# EAGLE design pulseSensor (EAGLE 8.2.2)
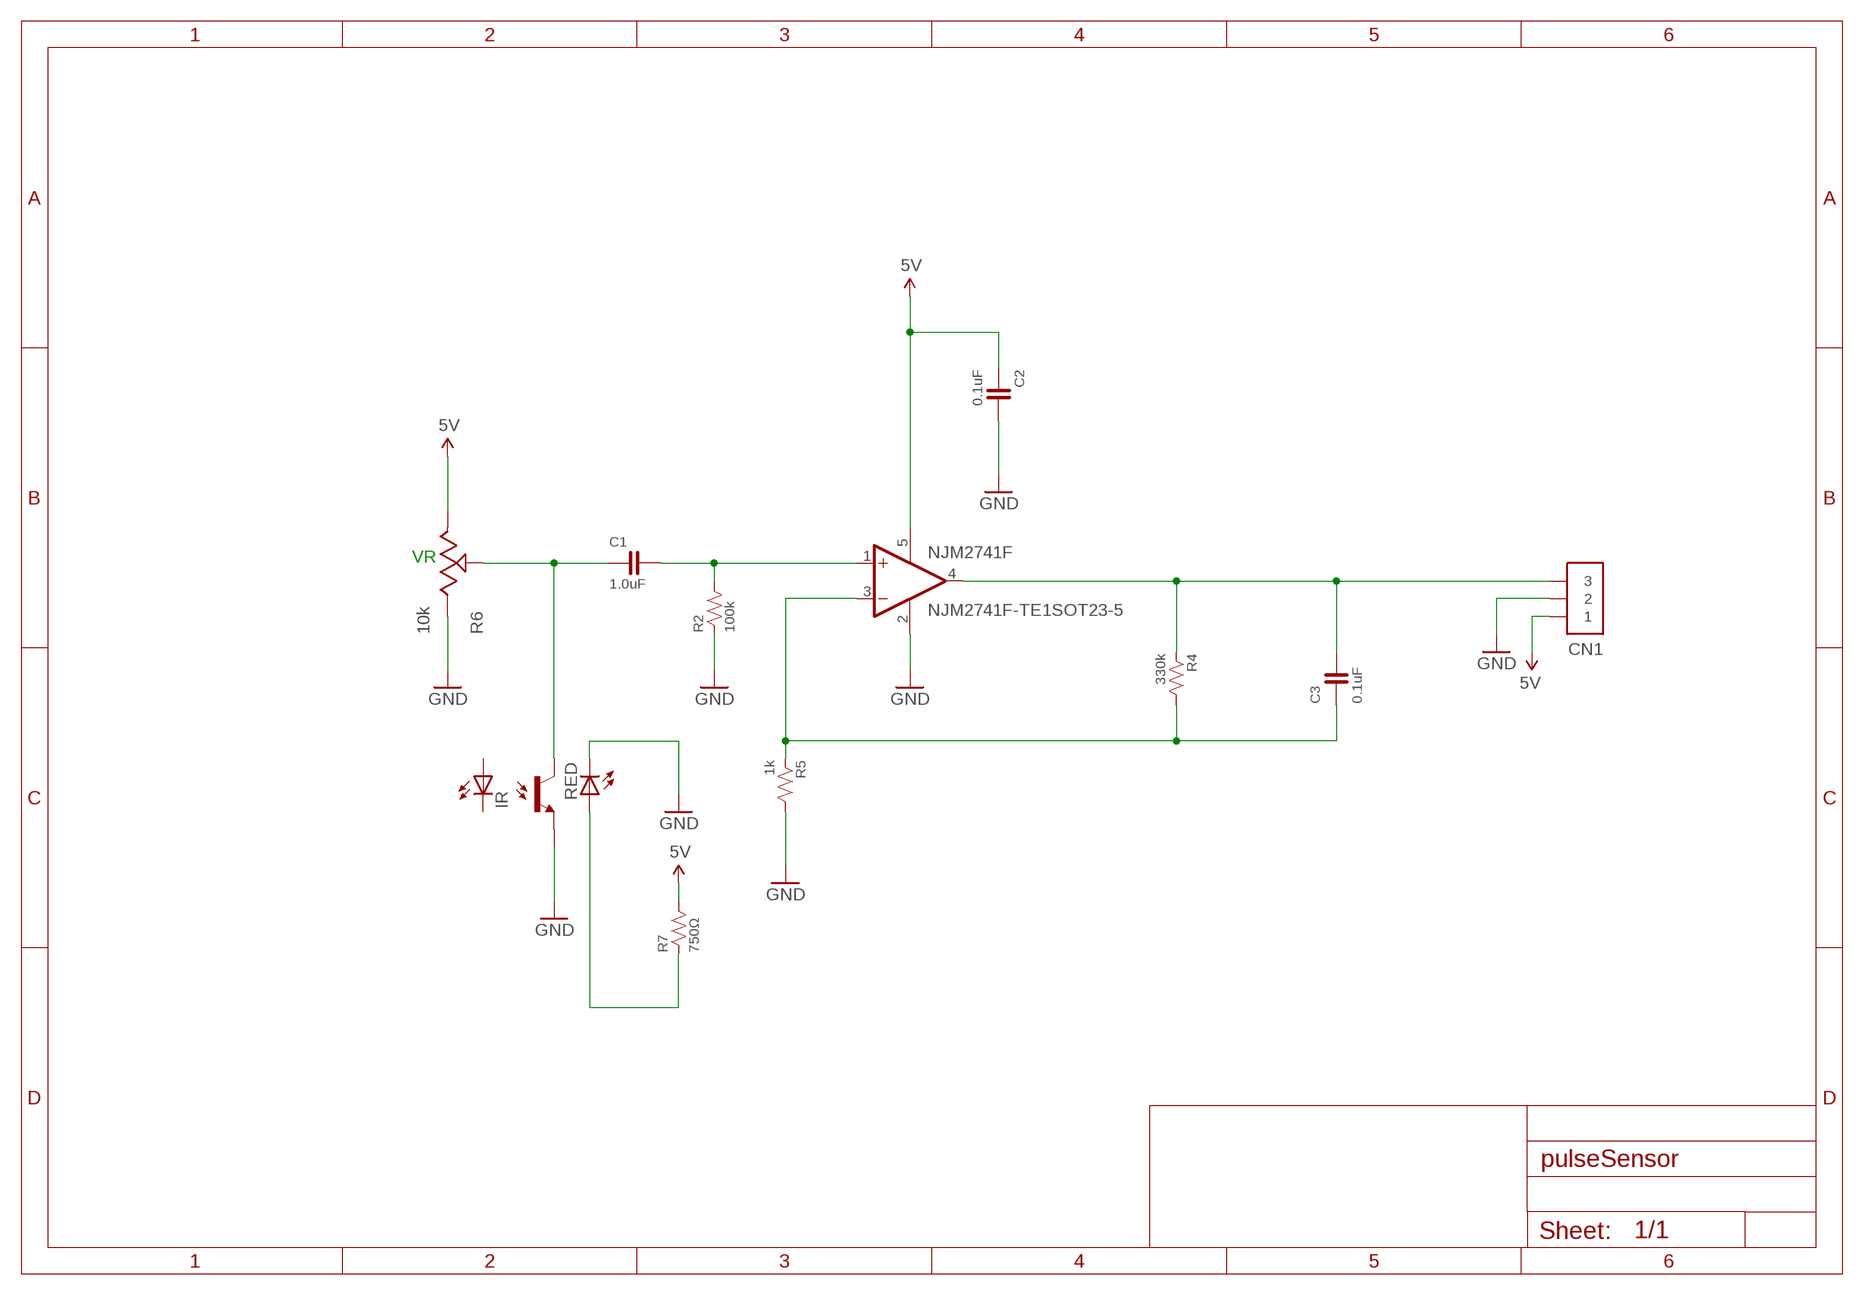
[diagram p0: schematic, sheet 1]

## Parts
C1  1.0uF  CAPACITOR-0603  [0603]
C2  0.1uF  CAPACITOR-0603  [0603]
C3  0.1uF  CAPACITOR-0603  [0603]
CN1  PIN_HEADER_1X3  [PIN_1X3]
NJL1  NJL5501R-TE1  [NJL5501R-PAC]
NJM2741F1  NJM2741F-TE1SOT23-5  [NJL5501R-PAC]
R2  100k  RESISTOR-0603  [0603]
R4  330k  RESISTOR-0603  [0603]
R5  1k  RESISTOR-0603  [0603]
R6  10k  RESISTOR_VARIABLE-SMD  [TC33X]
R7  750Ω  RESISTOR-0603  [0603]

## Nets
5V: C2.1 CN1.1 NJM2741F1.5(V+) R6.1 R7.2
GND: C2.2 CN1.2 NJL1.1 NJM2741F1.2(GND) R2.1 R5.2 R6.3
N$1: C3.2 CN1.3 NJM2741F1.4(OUT) R4.1
N$2: C1.1 NJL1.5 R6.2
N$3: C3.1 NJM2741F1.3(-IN) R4.2 R5.1
N$4: NJL1.6 R7.1
N$8: C1.2 NJM2741F1.1(+IN) R2.2
Unconnected: NJL1.2 NJL1.3 NJL1.4

## Notes on the sheet
- VR

## Library data of the parts
C1-C3 = FaBo-Capacitor:CAPACITOR: CAPACITOR
CN1 = FaBo-PIN:PIN_HEADER_1X3
NJL1 = njl5501r:NJL5501R-TE1
NJM2741F1 = NJM2741F-TE1:NJM2741F-TE1
R2 R4 R5 R7 = FaBo-Resistors:RESISTOR: RESISTOR
R6 = FaBo-Resistors:RESISTOR_VARIABLE

## Board
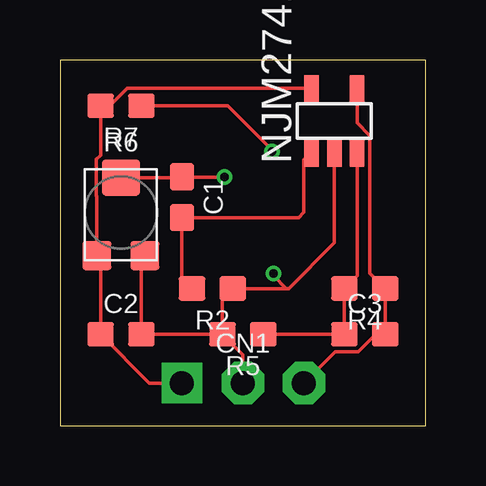
[diagram p1: board, top side]
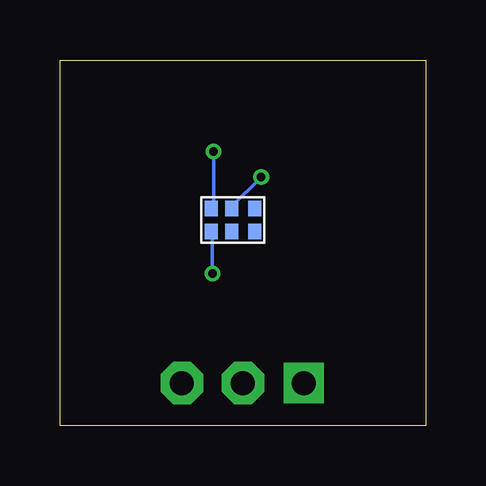
[diagram p2: board, bottom side, seen from below]

Size 15.24 x 15.24 mm. Coordinates in mm from the lower left corner, seen from the top.
Outline: 0,0 15.24,0 15.24,15.24 0,15.24 0,0
Copper layers (1*16): Top 0.035mm / dielectric 1.5mm / Bottom 0.035mm
Design rules "SeeedStudio_2layer_DRU_no_angle_20140221": minimum track width 6mil, minimum drill 12mil, track to track 6mil, track to pad 6mil, pad to pad 6mil, via to via 6mil, smd to smd 0mil, copper to edge 10mil, drill to drill 10mil, minimum pad ring 10mil, minimum via ring 6mil, stop-mask expansion 2mil, vias tented up to drill 100mil, thermal gap 10mil

### Footprints (pad centres in the part's own frame; a part is rotated, then mirrored left to right if it is on the bottom)
0603 = smd 1.1 x 1: 1 -0.85,0; 2 0.85,0
PIN_1X3 = drill 1 pad 1.676 square: 1 -2.54,0 | drill 1 pad 1.778 octagon: 2 0,0; 3 2.54,0
NJL5501R-PAC = smd 0.55 x 0.65: 1 -0.935,-0.155; 2 -0.086,-0.165; 3 0.875,-0.155; 4 0.875,0.795; 5 -0.085,0.795; 6 -0.935,0.795
NJL5501R-PAC' = smd 0.6 x 1.2: 1 -0.95,-1.306; 2 0,-1.306; 3 0.95,-1.306; 4 0.95,1.306; 5 -0.95,1.306
TC33X = smd 1.2 x 1.2: 1 -1,-1.8; 3 1,-1.8 | smd 1.6 x 1.5: 2 0,1.45

### Placement (x,y rotation side)
C1  5.08,9.53 270 top
C2  2.54,3.81 0 top
C3  12.7,3.81 0 top
CN1  7.62,1.78 0 top
NJL1  8,8.26 0 bottom
NJM2741F1  NJM2741F-TE1SOT23-5  [NJL5501R-PAC']  11.43,12.7 0 top
R2  6.35,5.71 180 top
R4  12.7,5.71 180 top
R5  7.62,3.81 180 top
R6  2.54,8.89 0 top
R7  2.54,13.34 180 top

### Tracks (layer width: path | path; a pad name or v marks a point on that pad's centre or on a via)
5V
  Top 0.152: CN1.1 3.72,1.78 C2.1 1.69,6.94 R6.1 1.54,9.55 1.51,9.58 1.51,11.1 1.69,11.28 R7.2 | R7.2 1.73,13.34 | R7.2 2.08,13.34 2.8,14.06 10.48,14.06 NJM2741F1.5
GND  (via drill 0.35)
  Top 0.152: CN1.2 7.62,2.96 R5.2 | R5.2 C2.2 3.39,6.94 R6.3 | R5.2 6.77,5.29 R2.1 9.44,5.71 | 9.44,5.71 9.53,5.71 11.43,7.62 NJM2741F1.2 | v8.89,6.35 8.89,6.26 9.44,5.71
  Bottom 0.152: NJL1.1 8.89,8.1 v8.89,6.35
N$1
  Top 0.152: NJM2741F1.4 12.38,12.62 12.91,12.09 12.91,6.36 R4.1 C3.2 13.16,3.81 12.44,3.08 11.46,3.08 CN1.3
N$2  (via drill 0.35)
  Top 0.152: R6.2 5.04,10.34 C1.1 5.18,10.36 v6.86,10.36
  Bottom 0.152: v6.86,10.36 8.08,9.14 NJL1.5
N$3
  Top 0.152: NJM2741F1.3 12.38,6.25 R4.2 C3.1 R5.1
N$4  (via drill 0.35)
  Top 0.152: R7.1 6.99,13.34 8.87,11.46 | 8.87,11.46 8.89,11.43 | v8.84,11.43 8.87,11.46
  Bottom 0.152: v8.84,11.43 8.84,9.14 NJL1.6
N$8
  Top 0.152: R2.2 5.08,6.13 C1.2 9.95,8.68 10.16,8.89 10.16,11.07 NJM2741F1.1